# Altium schematic sheet Microocontroller.SchDoc
size A3; SheetNumber: 5; SheetTotal: 6
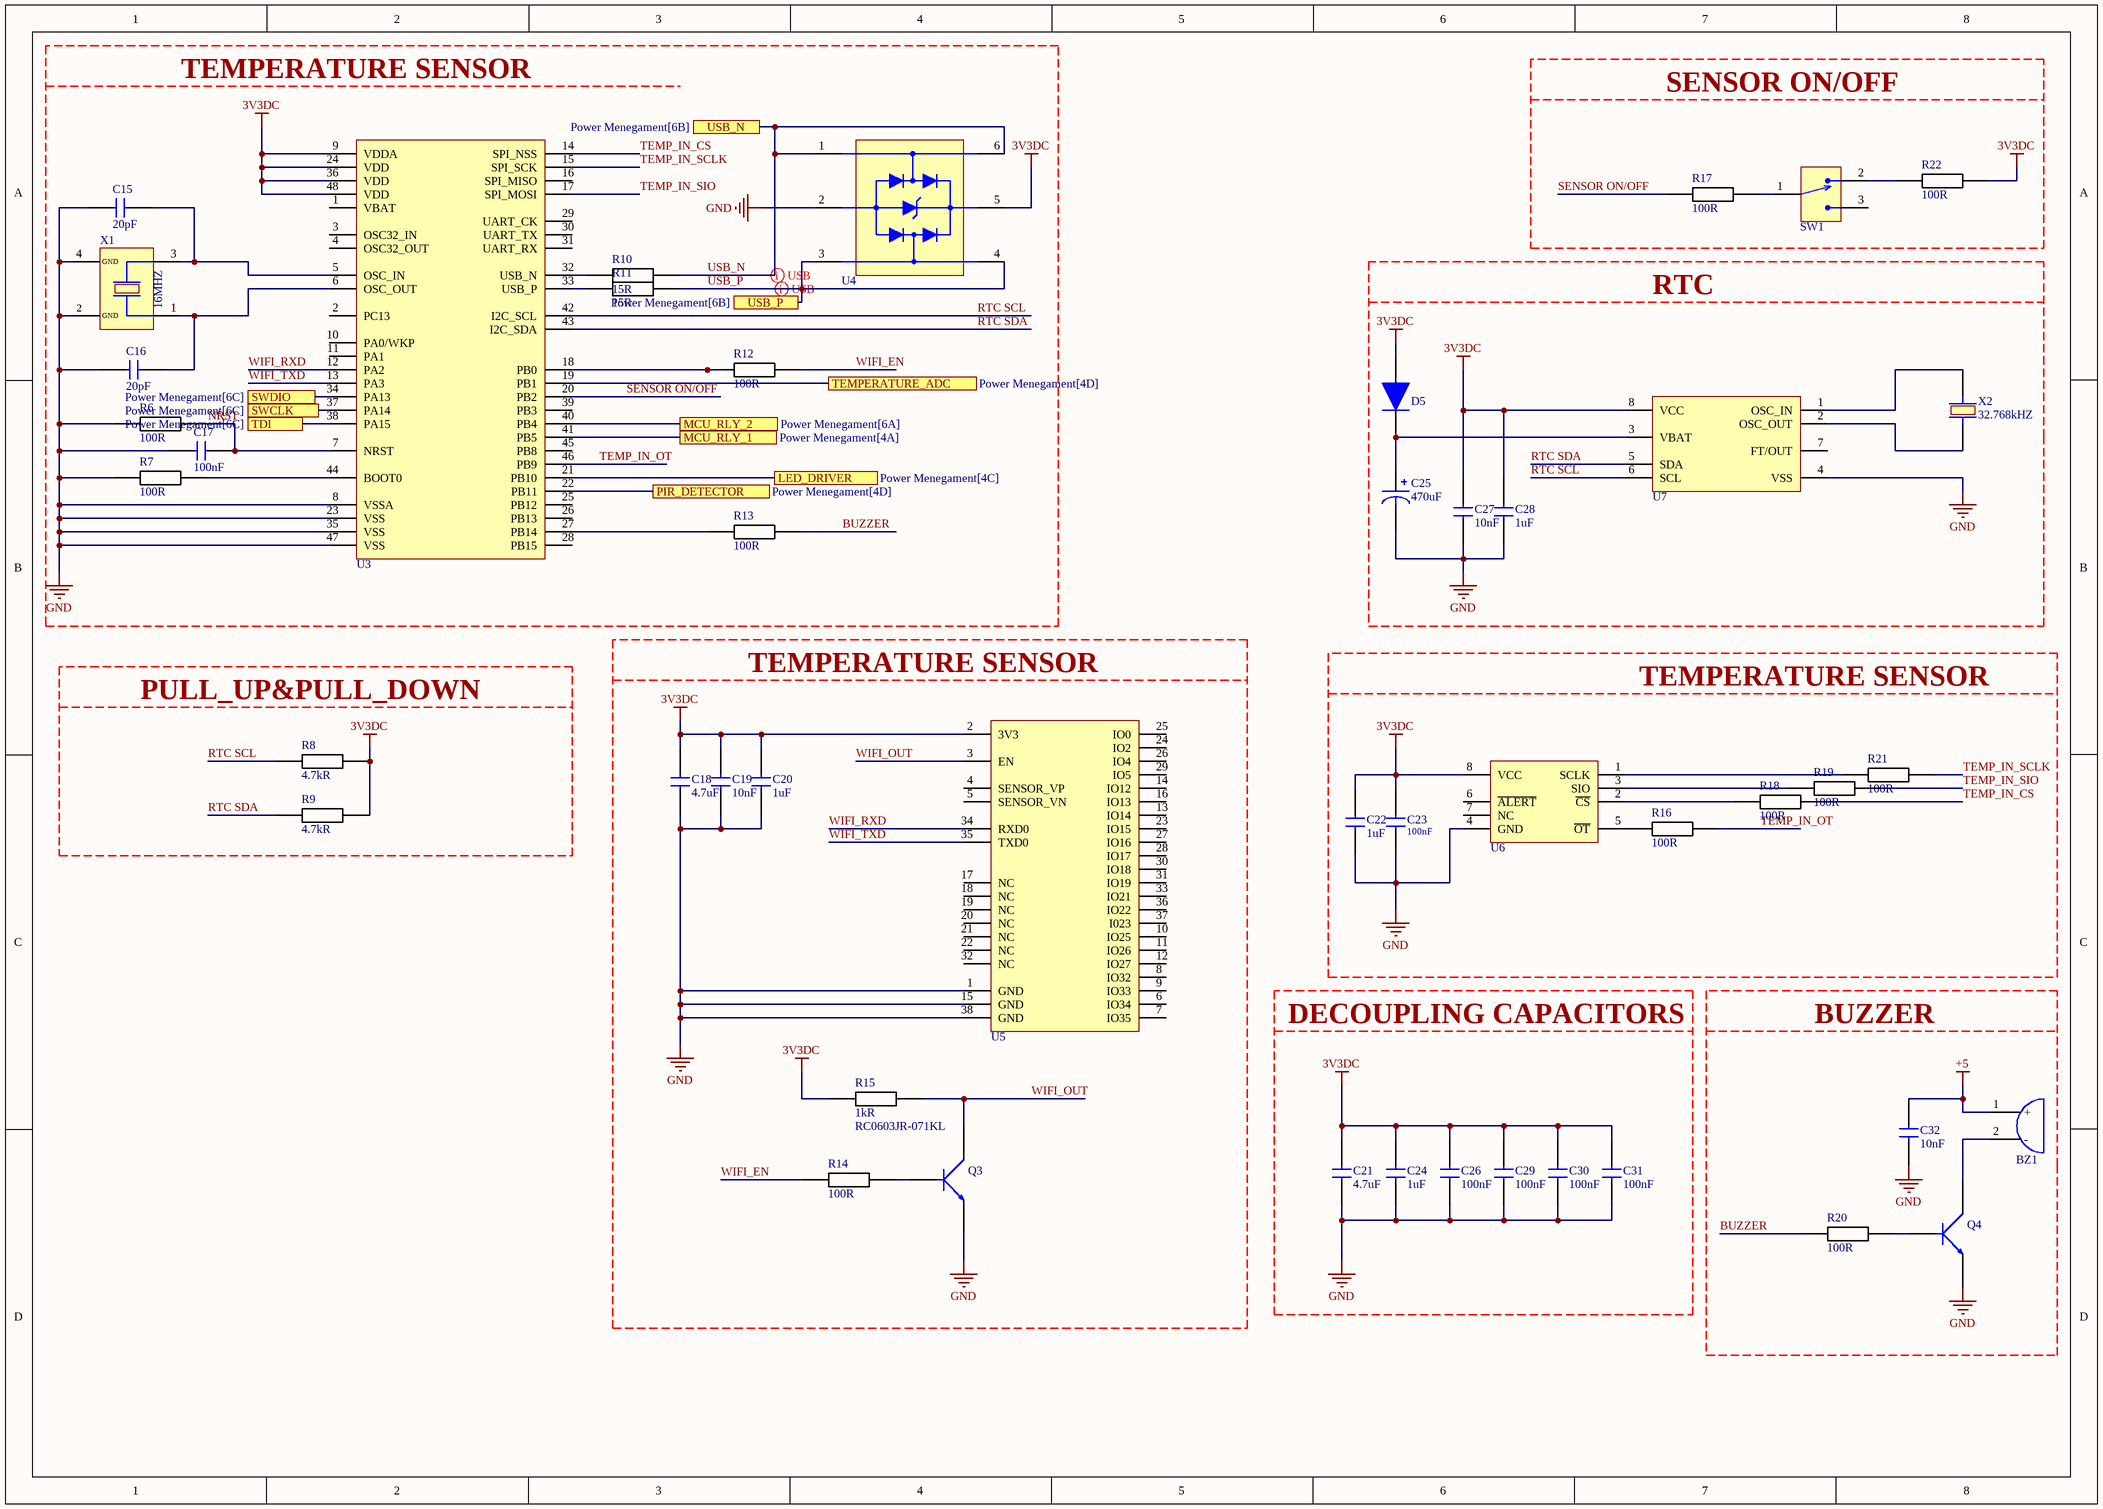
[diagram p0: Microocontroller.SchDoc]

## Parts
BZ1  CMI-9605IC-0580T  [CMI-9605IC]  (value not drawn)
C15  value 20pF  [CAP_0603]  (hidden comment: CL10C200JB8NNNC)
C16  value 20pF  [CAP_0603]  (hidden comment: CL10C200JB8NNNC)
C17  value 100nF  [CAP_0805]  (hidden comment: CL21B104KBCNNNC)
C18  value 4.7uF  [CAP_0805]  (hidden comment: CL21A475KAQNNNE)
C19  value 10nF  [CAP_0603]  (hidden comment: 0603B103K160CT)
C20  value 1uF  [CAP_0805]  (hidden comment: CHA08C105K4RXL7189)
C21  value 4.7uF  [CAP_0805]  (hidden comment: CL21A475KAQNNNE)
C22  value 1uF  [CAP_0805]  (hidden comment: CHA08C105K4RXL7189)
C23  value 100nF  [CAP_0603]  (hidden comment: C0603C104M5RACTU)
C24  value 1uF  [CAP_0805]  (hidden comment: CHA08C105K4RXL7189)
C25  value 470uF  [CAP_RADİAL_D10_R5]  (hidden comment: ESH477M035AH4AA)
C26  value 100nF  [CAP_0805]  (hidden comment: CL21B104KBCNNNC)
C27  value 10nF  [CAP_0603]  (hidden comment: 0603B103K160CT)
C28  value 1uF  [CAP_0805]  (hidden comment: CHA08C105K4RXL7189)
C29  value 100nF  [CAP_0805]  (hidden comment: CL21B104KBCNNNC)
C30  value 100nF  [CAP_0805]  (hidden comment: CL21B104KBCNNNC)
C31  value 100nF  [CAP_0805]  (hidden comment: CL21B104KBCNNNC)
C32  value 10nF  [CAP_0603]  (hidden comment: 0603B103K160CT)
D5  1N4148WS  [SOD323F]  (value not drawn)
Q3  MMBT3904-7-F  [SOT-23F]  (value not drawn)
Q4  MMBT3904-7-F  [SOT-23F]  (value not drawn)
R6  value 100R  [RES_0603]  (hidden comment: RC0603FR-07100RL)
R7  value 100R  [RES_0603]  (hidden comment: RC0603FR-07100RL)
R8  value 4.7kR  [RES_0603]  (hidden comment: RC0603JR-074K7L)
R9  value 4.7kR  [RES_0603]  (hidden comment: RC0603JR-074K7L)
R10  value 15R  [RES_0603]  (hidden comment: RC0603JR-0715RL)
R11  value 15R  [RES_0603]  (hidden comment: RC0603JR-0715RL)
R12  value 100R  [RES_0603]  (hidden comment: RC0603FR-07100RL)
R13  value 100R  [RES_0603]  (hidden comment: RC0603FR-07100RL)
R14  value 100R  [RES_0603]  (hidden comment: RC0603FR-07100RL)
R15  RC0603JR-071KL  value 1kR  [RES_0603]
R16  value 100R  [RES_0603]  (hidden comment: RC0603FR-07100RL)
R17  value 100R  [RES_0603]  (hidden comment: RC0603FR-07100RL)
R18  value 100R  [RES_0603]  (hidden comment: RC0603FR-07100RL)
R19  value 100R  [RES_0603]  (hidden comment: RC0603FR-07100RL)
R20  value 100R  [RES_0603]  (hidden comment: RC0603FR-07100RL)
R21  value 100R  [RES_0603]  (hidden comment: RC0603FR-07100RL)
R22  value 100R  [RES_0603]  (hidden comment: RC0603FR-07100RL)
SW1  EG1215AA  [EG1215AA]  (value not drawn)
U3  STM32F103C6T6A  [LQFP48]  (value not drawn)
U4  USBLC6-2SC6  [SOT-23-6L]  (value not drawn)
U5  ESP32-WROOM-32E-4MB  [ESP32-32E]  (value not drawn)
U6  MAX6662  [SOIC8]  (value not drawn)
U7  M41T00SM6F  [SOIC8]  (value not drawn)
X1  CRYSTAL_Value: 16MHZ  [ECS]  (hidden comment: ECS-160-20-30B-TR)
X2  CRYSTAL_Value: 32.768kHZ  [ABS05]  (hidden comment: ABS05-32.768KHZ-T)

## Blocks framed on the sheet
TEMPERATURE SENSOR: C15-C17 R6 R7 R10-R13 U3 U4 X1
SENSOR ON/OFF: R17 R22 SW1
RTC: C25 C27 C28 D5 U7 X2
PULL_UP&PULL_DOWN: R8 R9
TEMPERATURE SENSOR: C18-C20 Q3 R14 R15 U5
TEMPERATURE SENSOR: C22 C23 R16 R18 R19 R21 U6
DECOUPLING CAPACITORS: C21 C24 C26 C29-C31
BUZZER: BZ1 C32 Q4 R20

## Ports
LED_DRIVER (see Power Menegament[4C]), MCU_RLY_1 (see Power Menegament[4A]), MCU_RLY_2 (see Power Menegament[6A]), PIR_DETECTOR (see Power Menegament[4D]), SWCLK (see Power Menegament[6C]), SWDIO (see Power Menegament[6C]), TDI (see Power Menegament[6C]), TEMPERATURE_ADC (see Power Menegament[4D]), USB_N (see Power Menegament[6B]), USB_P (see Power Menegament[6B])

## Nets
3V3DC: C18.2 C19.2 C20.2 C21.2 C22.2 C23.2 C24.2 C26.2 C27.2 C28.2 C29.2 C30.2 C31.2 D5.2 R8.2 R9.2 R15.1 R22.2 U3.9(VDDA) U3.24(VDD) U3.36(VDD) U3.48(VDD) U4.5 U5.2(3V3) U6.8(VCC) U7.8(VCC)
+5: BZ1.1(+) C32.2
GND: C15.2 C16.1 C17.2 C18.1 C19.1 C20.1 C21.1 C22.1 C23.1 C24.1 C25.2 C26.1 C27.1 C28.1 C29.1 C30.1 C31.1 C32.1 Q3.2(E) Q4.2(E) R6.1 R7.1 U3.8(VSSA) U3.23(VSS) U3.35(VSS) U3.47(VSS) U4.2 U5.1(GND) U5.15(GND) U5.38(GND) U6.4(GND) U7.4(VSS) X1.2(GND) X1.4(GND)
BUZZER: R13.2 R20.1
LED_DRIVER: U3.21(PB10) ; port LED_DRIVER
MCU_RLY_1: U3.41(PB5) ; port MCU_RLY_1
MCU_RLY_2: U3.40(PB4) ; port MCU_RLY_2
NRST: C17.1 R6.2 U3.7(NRST)
PIR_DETECTOR: U3.22(PB11) ; port PIR_DETECTOR
RTC SCL: R8.1 U3.42(I2C_SCL) U7.6(SCL)
RTC SDA: R9.1 U3.43(I2C_SDA) U7.5(SDA)
SENSOR ON/OFF: R17.1 U3.20(PB2)
SWCLK: U3.37(PA14) ; port SWCLK
SWDIO: U3.34(PA13) ; port SWDIO
TDI: U3.38(PA15) ; port TDI
TEMP_IN_CS: R18.2 U3.14(SPI_NSS)
TEMP_IN_OT: R16.2 U3.46(PB9)
TEMP_IN_SCLK: R21.2 U3.15(SPI_SCK)
TEMP_IN_SIO: R19.2 U3.17(SPI_MOSI)
TEMPERATURE_ADC: U3.19(PB1) ; port TEMPERATURE_ADC
USB_N: R10.2 U4.1 U4.6 ; port USB_N
USB_P: R11.2 U4.3 U4.4 ; port USB_P
WIFI_EN: R12.2 R14.1
WIFI_OUT: Q3.3(C) R15.2 U5.3(EN)
WIFI_RXD: U3.12(PA2) U5.34(RXD0)
WIFI_TXD: U3.13(PA3) U5.35(TXD0)
NetBZ1_2: BZ1.2(-) Q4.3(C)
NetC15_1: C15.1 U3.5(OSC_IN) X1.3
NetC16_2: C16.2 U3.6(OSC_OUT) X1.1
NetC25_1: C25.1 D5.1 U7.3(VBAT)
NetQ3_1: Q3.1(B) R14.2
NetQ4_1: Q4.1(B) R20.2
NetR7_2: R7.2 U3.44(BOOT0)
NetR10_1: R10.1 U3.32(USB_N)
NetR11_1: R11.1 U3.33(USB_P)
NetR12_1: R12.1 U3.18(PB0)
NetR13_1: R13.1 U3.27(PB14)
NetR16_1: R16.1 U6.5(~{OT})
NetR17_2: R17.2 SW1.1
NetR18_1: R18.1 U6.2(~{CS})
NetR19_1: R19.1 U6.3(SIO)
NetR21_1: R21.1 U6.1(SCLK)
NetR22_1: R22.1 SW1.2
NetU7_1: U7.1(OSC_IN) X2.2
NetU7_2: U7.2(OSC_OUT) X2.1

Not connected (* = marked no-connect by the designer): SW1 3; U3 1(VBAT) 2(PC13) 3(OSC32_IN) 4(OSC32_OUT) 10(PA0/WKP) 11(PA1) 16(SPI_MISO) 25(PB12) 26(PB13) 28(PB15) 29(UART_CK) 30(UART_TX) 31(UART_RX) 39(PB3) 45(PB8); U5 4(SENSOR_VP) 5(SENSOR_VN) 6(IO34) 7(IO35) 8(IO32) 9(IO33) 10(IO25) 11(IO26) 12(IO27) 13(IO14) 14(IO12) 16(IO13) 17(NC) 18(NC) 19(NC) 20(NC) 21(NC) 22(NC) 23(IO15) 24(IO2) 25(IO0) 26(IO4) 27(IO16) 28(IO17) 29(IO5) 30(IO18) 31(IO19) 32(NC) 33(IO21) 36(IO22) 37(I023); U6 6(~{ALERT}) 7(NC); U7 7(FT/OUT)

## Layout directives
differential pair: USB_N, USB_P

## Library data of the parts
BZ1 = CMI-9605IC-0580T: Buzzers Indicator, Internally Driven Magnetic 5 V 30mA 2.7kHz 80dB @ 5V, 10cm Through Hole PC Pins; Manufacturer: CUI Devices; Designed by: Kerem; Supplier: Digikey; Supplier Part Number: 2223-CMI-9605IC-0580T-ND; Manufacturer Part Number: CMI-9605IC-0580T; RoHS: No; Category: Buzzers; Stock: 3266; Pricing: 1=1,14, 10=0,932, 25=0,8584, 50=0,8072, 150=0,73213, 300=0,73127 (USD); ComponentLink1Description: DATASHEET; ComponentLink1URL: https://www.sameskydevices.com/product/resource/cmi-9605ic-0580t.pdf
C15 C16 = CAP_CER_20pF_0603: Ceramic Capacitor, 50V, 0.00002uF, Surface Mount, 0603; Manufacturer: Samsung; Multilayer: Yes; Tolerance  (fill in as +-): 5%; Temperature Characteristics Code: C0G; Designed by: Kerem; Supplier: Digikey; Supplier Part Number: 1276-1187-1-ND; Manufacturer Part Number: CL10C200JB8NNNC; RoHS: Yes; Category: Ceramic Capacitors; Stock: 238617; Pricing: 1=0,1, 10=0,029, 100=0,0173, 1000=0,01144 (USD); Mounting Technology: Surface Mount; Pins: 2; Dielectric Material: Ceramic; Package Shape: Rectangular; Case/Package: 0603; Terminal Finish: Nickel; Min Operating Temperature: -55°C; Max Operating Temperature: 125°C; JESD-609 Code: e3; Capacitor Type: Ceramic; Package Style: SMTMeter; Packaging: Tape and Reel; Tolerance (fill in as +-): 5%; Rated DC Voltage (URdc): 50V; Termination: Wraparound; Length: 1.6mm; Width: 0.8mm; Height: 0.9mm; Reach SVHC Compliant: Yes; RoHS Compliant: Yes; ComponentLink1URL: https://datasheet.ciiva.com:443/pdfs/VipMasterIC/IC/SEMS/SEMS-S-A0008520096/SEMS-S-A0008519968-1.pdf?src-supplier=IHS+Markit; ComponentLink1Description: https://datasheet.ciiva.com:443/pdfs/VipMasterIC/IC/SEMS/SEMS-S-A0008520096/SEMS-S-A0008519968-1.pdf?src-supplier=IHS+Markit; ComponentLink2URL: https://datasheet.ciiva.com/26877/getdatasheetpartid-640634-26877974.pdf?src-supplier=Verical; ComponentLink2Description: https://datasheet.ciiva.com/26877/getdatasheetpartid-640634-26877974.pdf?src-supplier=Verical; ComponentLink3URL: https://datasheet.ciiva.com/26310/mlcc-catalogdownload2013-eng-26310315.pdf?src-supplier=Distrelec; ComponentLink3Description: https://datasheet.ciiva.com/26310/mlcc-catalogdownload2013-eng-26310315.pdf?src-supplier=Distrelec
C17 C26 C29-C31 = CAP_CER_100nF_0805: Ceramic Capacitor,50V, %10, 0.1uF, Surface Mount, 0805; Manufacturer: Samsung; Multilayer: Yes; Tolerance  (fill in as +-): 10%; Temperature Characteristics Code: X7R; Designed by: Kerem; Supplier: Digikey; Supplier Part Number: 1276-1003-1-ND; Manufacturer Part Number: CL21B104KBCNNNC; RoHS: Yes; Category: Ceramic Capacitors; Stock: 925106; Pricing: 1=0,1, 10=0,029, 100=0,0175, 1000=0,01156 (USD); Mounting Technology: Surface Mount; Pins: 2; Dielectric Material: Ceramic; Package Shape: Rectangular; Case/Package: 0805; Terminal Finish: Nickel; Min Operating Temperature: -55°C; Max Operating Temperature: 125°C; JESD-609 Code: e3; Capacitor Type: Ceramic; Package Style: SMTMeter; Packaging: Tape and Reel; Tolerance (fill in as +-): 10%; Rated DC Voltage (URdc): 50V; Termination: Wraparound; Length: 2mm; Width: 1.25mm; Height: 0.95mm; Reach SVHC Compliant: Yes; RoHS Compliant: Yes; ComponentLink1URL: https://datasheet.ciiva.com:443/pdfs/VipMasterIC/IC/SEMS/SEMS-S-A0008521003/SEMS-S-A0008521039-1.pdf?src-supplier=IHS+Markit; ComponentLink1Description: https://datasheet.ciiva.com:443/pdfs/VipMasterIC/IC/SEMS/SEMS-S-A0008521003/SEMS-S-A0008521039-1.pdf?src-supplier=IHS+Markit; ComponentLink2URL: https://datasheet.ciiva.com/25710/cl21b104kbcnnnc-25710182.pdf?src-supplier=Digikey; ComponentLink2Description: https://datasheet.ciiva.com/25710/cl21b104kbcnnnc-25710182.pdf?src-supplier=Digikey; ComponentLink3URL: https://datasheet.ciiva.com/29199/454152-da-01-en-vs-kondensator-0805-29199814.pdf?src-supplier=Conrad; ComponentLink3Description: https://datasheet.ciiva.com/29199/454152-da-01-en-vs-kondensator-0805-29199814.pdf?src-supplier=Conrad
C18 C21 = CAP_CER_4.7uF_0805: CAP CER 4.7uF,%10, Surface Mount, 0805; Manufacturer: Samsung; Designed by: Kerem; Dielectric Material: Ceramic; Multilayer: Yes; Tolerance  (fill in as +-): 10%; Rated DC Voltage (URdc): 25V; Temperature Characteristics Code: X5R; Supplier: Digikey; Supplier Part Number: 1276-1244-1-ND; Manufacturer Part Number: CL21A475KAQNNNE; RoHS: Yes; Category: Ceramic Capacitors; Stock: 2727040; Pricing: 1=0,1, 10=0,048, 100=0,03, 1000=0,02035 (USD); Mounting Technology: Surface Mount; Pins: 2; Package Shape: Rectangular; Case/Package: 0805; Terminal Finish: Nickel; Min Operating Temperature: -55°C; Max Operating Temperature: 85°C; JESD-609 Code: e3; Capacitor Type: Ceramic; Package Style: SMTMeter; Packaging: Tape and Reel; Tolerance (fill in as +-): 10%; Termination: Wraparound; Length: 2mm; Width: 1.25mm; Height: 1.4mm; Reach SVHC Compliant: Yes; RoHS Compliant: Yes; ComponentLink1URL: https://datasheet.ciiva.com:443/pdfs/VipMasterIC/IC/SEMS/SEMS-S-A0008528919/SEMS-S-A0008528938-1.pdf?src-supplier=IHS+Markit; ComponentLink1Description: https://datasheet.ciiva.com:443/pdfs/VipMasterIC/IC/SEMS/SEMS-S-A0008528919/SEMS-S-A0008528938-1.pdf?src-supplier=IHS+Markit; ComponentLink2URL: https://datasheet.ciiva.com/25798/cl21a475kaqnnne-25798882.pdf?src-supplier=Digikey; ComponentLink2Description: https://datasheet.ciiva.com/25798/cl21a475kaqnnne-25798882.pdf?src-supplier=Digikey
C19 C27 C32 = CAP_CER_10nF_0603: Ceramic Capacitor,16V, 10%, 0.01uF, Surface Mount, 0603; Manufacturer: Walsin Technologies; Designed by: Kerem; Multilayer: Yes; Temperature Characteristics Code: X7R; Supplier: Digikey; Supplier Part Number: 1292-1384-6-ND; Manufacturer Part Number: 0603B103K160CT; RoHS: Yes; Category: Ceramic Capacitors; Stock: 40006; Pricing: 1=0,1, 10=0,031, 50=0,018, 100=0,0139, 500=0,0105, 1000=0,00825 (USD); Mounting Technology: Surface Mount; Pins: 2; Dielectric Material: Ceramic; Case/Package: 0603; Package Shape: Rectangular; Terminal Finish: Nickel; Min Operating Temperature: -55°C; Max Operating Temperature: 125°C; Capacitor Type: Ceramic; Tolerance  (fill in as +-): 10%; Package Style: SMTMeter; Packaging: Tape and Reel; Tolerance (fill in as +-): 10%; Rated DC Voltage (URdc): 16V; JESD-609 Code: e3; Termination: Wraparound; Length: 1.6mm; Width: 0.8mm; Height: 0.8mm; Reach SVHC Compliant: Yes; RoHS Compliant: Yes; ComponentLink1URL: https://datasheet.ciiva.com:443/pdfs/VipMasterIC/IC/WATC/WATC-S-A0009550342/WATC-S-A0009550342-1.pdf?src-supplier=IHS+Markit; ComponentLink1Description: https://datasheet.ciiva.com:443/pdfs/VipMasterIC/IC/WATC/WATC-S-A0009550342/WATC-S-A0009550342-1.pdf?src-supplier=IHS+Markit; ComponentLink2URL: http://www.farnell.com/datasheets/1958513.pdf?src-supplier=Farnell; ComponentLink2Description: http://www.farnell.com/datasheets/1958513.pdf?src-supplier=Farnell; ComponentLink3URL: https://datasheet.octopart.com/0603B103K160CT-Walsin-Technologies-datasheet-85392065.pdf?src-supplier=Element14; ComponentLink3Description: https://datasheet.octopart.com/0603B103K160CT-Walsin-Technologies-datasheet-85392065.pdf?src-supplier=Element14; ComponentLink4URL: http://www.passivecomponent.com/wp-content/uploads/2018/10/MLCC.pdf?src-supplier=Digikey; ComponentLink4Description: http://www.passivecomponent.com/wp-content/uploads/2018/10/MLCC.pdf?src-supplier=Digikey; ComponentLink5URL: https://datasheet.octopart.com/0603B103K160CT-Walsin-Technologies-datasheet-136037192.pdf?src-supplier=Future+Electronics; ComponentLink5Description: https://datasheet.octopart.com/0603B103K160CT-Walsin-Technologies-datasheet-136037192.pdf?src-supplier=Future+Electronics; ComponentLink6URL: https://datasheet.octopart.com/0603B103K160CT-Walsin-Technologies-datasheet-62066062.pdf?src-supplier=TME; ComponentLink6Description: https://datasheet.octopart.com/0603B103K160CT-Walsin-Technologies-datasheet-62066062.pdf?src-supplier=TME
C20 C22 C24 C28 = CAP_CER_1uF_0805: Cap CER, 1uF, 16V, 0805;; Manufacturer: KEMET; Designed by: Kerem; Supplier: Digikey; Supplier Part Number: 399-CHA08C105K4RXL7189DKR-ND; Manufacturer Part Number: CHA08C105K4RXL7189; Stock: 600; Pricing: 1=8,82, 10=6,341, 100=4,9085 (USD); ComponentLink1URL: https://datasheet.octopart.com/CHA08C105K4RXL7189-KEMET-datasheet-181963755.pdf?src-supplier=Farnell; ComponentLink1Description: https://datasheet.octopart.com/CHA08C105K4RXL7189-KEMET-datasheet-181963755.pdf?src-supplier=Farnell
C23 = CAP CER 100nF 0603: 0.1 µF ±20% 50V Ceramic Capacitor X7R 0603 (1608 Metric); Manufacturer: KEMET; Supplier: Digikey; Supplier Part Number: 399-C0603C104M5RACTUCT-ND; Manufacturer Part Number: C0603C104M5RACTU; RoHS: Yes; Category: Ceramic Capacitors; Stock: 3718959; Pricing: 1=0,1, 10=0,023, 100=0,0133, 1000=0,00866, 4000=0,00697, 8000=0,00632, 12000=0,00598, 20000=0,0056, 28000=0,00538, 40000=0,00516, 100000=0,00467, 200000=0,00436, 400000=0,0041 (USD); ComponentLink1URL: http://capacitoredge.kemet.com:80/capedge2/intellispec.jsp?pn=P2015898&displayPN=P2015898&src-supplier=IHS+Markit; ComponentLink1Description: http://capacitoredge.kemet.com:80/capedge2/intellispec.jsp?pn=P2015898&displayPN=P2015898&src-supplier=IHS+Markit; ComponentLink2URL: http://components.arrow.com/part/dataview/40911037S8853915N7429?src-supplier=Arrow+Electronics; ComponentLink2Description: http://components.arrow.com/part/dataview/40911037S8853915N7429?src-supplier=Arrow+Electronics; ComponentLink3URL: http://www.farnell.com/datasheets/2746056.pdf?src-supplier=Farnell; ComponentLink3Description: http://www.farnell.com/datasheets/2746056.pdf?src-supplier=Farnell; ComponentLink4URL: https://www.verical.com/server-webapp/html/getDatasheet?partID=626892&src-supplier=Verical; ComponentLink4Description: https://www.verical.com/server-webapp/html/getDatasheet?partID=626892&src-supplier=Verical; ComponentLink5URL: http://www.mouser.com/ds/2/212/KEM_C1002_X7R_SMD-1102033.pdf?src-supplier=Mouser; ComponentLink5Description: http://www.mouser.com/ds/2/212/KEM_C1002_X7R_SMD-1102033.pdf?src-supplier=Mouser; ComponentLink6URL: http://www.alliedelec.com/m/d/6f3b5eb83d09db50ed28bdc730567b33.pdf?src-supplier=Allied+Electronics; ComponentLink6Description: http://www.alliedelec.com/m/d/6f3b5eb83d09db50ed28bdc730567b33.pdf?src-supplier=Allied+Electronics; ComponentLink7URL: http://www.farnell.com/datasheets/1828800.pdf?src-supplier=Newark; ComponentLink7Description: http://www.farnell.com/datasheets/1828800.pdf?src-supplier=Newark; ComponentLink8URL: https://datasheet.octopart.com/C0603C104M5RACTU-Kemet-datasheet-5313890.pdf?src-supplier=Verical; ComponentLink8Description: https://datasheet.octopart.com/C0603C104M5RACTU-Kemet-datasheet-5313890.pdf?src-supplier=Verical; ComponentLink9URL: http://capacitoredge.kemet.com/capedge2/DataSheet?pn=C0603C104M5RAC7867&src-supplier=Avnet; ComponentLink9Description: http://capacitoredge.kemet.com/capedge2/DataSheet?pn=C0603C104M5RAC7867&src-supplier=Avnet; ComponentLink10URL: http://www.farnell.com/datasheets/2315113.pdf?src-supplier=Newark; ComponentLink10Description: http://www.farnell.com/datasheets/2315113.pdf?src-supplier=Newark; ComponentLink11URL: https://api.kemet.com/component-edge/download/datasheet/C0603C104M5RACTU.pdf?src-supplier=Digikey; ComponentLink11Description: https://api.kemet.com/component-edge/download/datasheet/C0603C104M5RACTU.pdf?src-supplier=Digikey; ComponentLink12URL: https://datasheet.octopart.com/C0603C104M5RACTU-Kemet-datasheet-65850025.pdf?src-supplier=Element14; ComponentLink12Description: https://datasheet.octopart.com/C0603C104M5RACTU-Kemet-datasheet-65850025.pdf?src-supplier=Element14; ComponentLink13URL: http://www.farnell.com/datasheets/2746056.pdf?src-supplier=Element14; ComponentLink13Description: http://www.farnell.com/datasheets/2746056.pdf?src-supplier=Element14; ComponentLink14URL: http://www.farnell.com/datasheets/2746056.pdf?src-supplier=Newark; ComponentLink14Description: http://www.farnell.com/datasheets/2746056.pdf?src-supplier=Newark; ComponentLink15URL: https://datasheet.octopart.com/C0603C104M5RACTU-KEMET-datasheet-157246124.pdf?src-supplier=Electro+Sonic; ComponentLink15Description: https://datasheet.octopart.com/C0603C104M5RACTU-KEMET-datasheet-157246124.pdf?src-supplier=Electro+Sonic; ComponentLink16URL: https://datasheet.octopart.com/C0603C104M5RACTU-KEMET-datasheet-68331906.pdf?src-supplier=TME; ComponentLink16Description: https://datasheet.octopart.com/C0603C104M5RACTU-KEMET-datasheet-68331906.pdf?src-supplier=TME
C25 = CAP_ALU_470uF: Aluminum Electrolytic Capacitor, Polarized, Aluminum (wet), 35V, 20% +Tol, 20% -Tol, 470uF, Through Hole Mount; Manufacturer: KEMET; Dielectric Material: Aluminium; Leakage Current: 167uA; Ripple Current: 580mA; Tan Delta: 0.14; Designed by: Kerem; Supplier: Digikey; Supplier Part Number: 399-ESH477M035AH4AA-ND; Manufacturer Part Number: ESH477M035AH4AA; RoHS: Yes; Category: Aluminum Electrolytic Capacitors; Pricing: 2400=0,16564 (USD); Mounting Technology: Through Hole; Pins: 2; Package Shape: Cylindrical; Min Operating Temperature: -40°C; Max Operating Temperature: 105°C; Polarity: Polarized; Capacitor Type: Aluminium; Tolerance  (fill in as +-): 20%; Package Style: RadialMeter; Packaging: Bulk; Tolerance (fill in as +-): 20%; Rated DC Voltage (URdc): 35V; Termination: Wire; Diameter: 10mm; Length: 19mm; Terminal Pitch: 5mm; Reach SVHC Compliant: Yes; RoHS Compliant: Yes; ComponentLink1URL: https://datasheet.ciiva.com:443/pdfs/VipMasterIC/IC/KEME/KEME-S-A0008512286/KEME-S-A0008512286-1.pdf?src-supplier=IHS+Markit; ComponentLink1Description: https://datasheet.ciiva.com:443/pdfs/VipMasterIC/IC/KEME/KEME-S-A0008512286/KEME-S-A0008512286-1.pdf?src-supplier=IHS+Markit; ComponentLink2URL: https://datasheet.ciiva.com/22627/1794402-22627147.pdf?src-supplier=Farnell; ComponentLink2Description: https://datasheet.ciiva.com/22627/1794402-22627147.pdf?src-supplier=Farnell
D5 = 1N4148WS: Rectifier Diode, 1 Phase, 1 Element, 0.15A, 100V V(RRM), Silicon; Manufacturer: ON Semiconductor / Fairchild; Package Body Material: Plastic; Number of Elements: 1; Max Output current: 150mA; Reverse Recovery Time-Max: 0.004us; Forward Voltage: 1V; Qualification Status: Not Qualified; Designed by: Kerem; Supplier: Digikey; Supplier Part Number: 1N4148WSFSCT-ND; Manufacturer Part Number: 1N4148WS; RoHS: Yes; Category: Rectifier Diodes; Stock: 336004; Pricing: 1=0,11, 10=0,066, 100=0,0485, 500=0,03852, 1000=0,03522 (USD); Pins: 2; Diode Element Material: SILICON; Package Shape: Rectangular; Max Operating Temperature: 150°C; Diode Type: RECTIFIER; JESD-30 Code: R-PDSO-F2; Package Style: SMALL OUTLINEMeter; Rep Pk Reverse Voltage-Max: 100V; Surface Mount: Yes; Terminal Form: Flat; Terminal Position: DUAL; Moisture Sensitivity Level: 1; Reach SVHC Compliant: Yes; RoHS Compliant: Yes; ComponentLink1URL: https://datasheet.ciiva.com:443/pdfs/VipMasterIC/IC/ONSM/ONSM-S-A0003392874/ONSM-S-A0003585195-1.pdf?src-supplier=IHS+Markit; ComponentLink1Description: https://datasheet.ciiva.com:443/pdfs/VipMasterIC/IC/ONSM/ONSM-S-A0003392874/ONSM-S-A0003585195-1.pdf?src-supplier=IHS+Markit; ComponentLink2URL: https://datasheet.ciiva.com/15208/getdatasheetpartid-127819-15208358.pdf?src-supplier=Verical; ComponentLink2Description: https://datasheet.ciiva.com/15208/getdatasheetpartid-127819-15208358.pdf?src-supplier=Verical; ComponentLink3URL: https://datasheet.ciiva.com/8300/1n914bws-8300360.pdf?src-supplier=Avnet; ComponentLink3Description: https://datasheet.ciiva.com/8300/1n914bws-8300360.pdf?src-supplier=Avnet; ComponentLink4URL: https://datasheet.ciiva.com/910/1n4148ws-910381.pdf?src-supplier=Digikey; ComponentLink4Description: https://datasheet.ciiva.com/910/1n4148ws-910381.pdf?src-supplier=Digikey; ComponentLink5URL: https://datasheet.ciiva.com/910/1n4148ws-910382.pdf?src-supplier=Digikey; ComponentLink5Description: https://datasheet.ciiva.com/910/1n4148ws-910382.pdf?src-supplier=Digikey; ComponentLink6URL: https://datasheet.ciiva.com/910/1n4148ws-910380.pdf?src-supplier=Digikey; ComponentLink6Description: https://datasheet.ciiva.com/910/1n4148ws-910380.pdf?src-supplier=Digikey
Q3 Q4 = MMBT3904-7-F: Small Signal Bipolar Transistor, 0.2A I(C), 40V V(BR)CEO, 1-Element, NPN, Silicon; Manufacturer: Diodes Zetex; Designed by: Kerem; Package Body Material: Plastic; Additional Feature: HIGH RELIABILITY; Max Collector Current: 200mA; DC Current Gain-Min (hFE): 30; Number of Elements: 1; Power Dissipation-Max (Abs): 300mW; Time @ Peak Reflow Temperature-Max (s): 40s; Transistor Application: SWITCHING; Frequency: 300MHz; Turn-off Time-Max (toff): 250ns; Turn-on Time-Max (ton): 70ns; Qualification Status: Not Qualified; Supplier: Digikey; Supplier Part Number: MMBT3904-FDICT-ND; Manufacturer Part Number: MMBT3904-7-F; RoHS: Yes; Category: BJTs; Stock: 3621103; Pricing: 1=0,12, 10=0,075, 100=0,0458, 500=0,03304, 1000=0,02888 (USD); Pins: 3; Package Shape: Rectangular; Terminal Finish: Tin; Transistor Element Material: SILICON; Max Operating Temperature: 150°C; JESD-609 Code: e3; Polarity/Channel Type: NPN; Collector-emitter Voltage-Max: 40V; JESD-30 Code: R-PDSO-G3; Moisture Sensitivity Level: 1; Package Style: SMALL OUTLINEMeter; Peak Reflow Temperature (Cel): 260°C; Surface Mount: Yes; Terminal Form: Gull Wing; Terminal Position: DUAL; Reach SVHC Compliant: Yes; RoHS Compliant: Yes; ComponentLink1URL: https://datasheet.ciiva.com:443/pdfs/VipMasterIC/IC/DIOD/DIOD-S-A0003133141/DIOD-S-A0003133141-1.pdf?src-supplier=IHS+Markit; ComponentLink1Description: https://datasheet.ciiva.com:443/pdfs/VipMasterIC/IC/DIOD/DIOD-S-A0003133141/DIOD-S-A0003133141-1.pdf?src-supplier=IHS+Markit; ComponentLink2URL: https://datasheet.ciiva.com/11201/ds30036-11201778.pdf?src-supplier=Avnet; ComponentLink2Description: https://datasheet.ciiva.com/11201/ds30036-11201778.pdf?src-supplier=Avnet; ComponentLink3URL: https://datasheet.ciiva.com/15138/getdatasheetpartid-53265-15138780.pdf?src-supplier=Verical; ComponentLink3Description: https://datasheet.ciiva.com/15138/getdatasheetpartid-53265-15138780.pdf?src-supplier=Verical; ComponentLink4URL: https://datasheet.ciiva.com/22711/1915516-22711750.pdf?src-supplier=Element14; ComponentLink4Description: https://datasheet.ciiva.com/22711/1915516-22711750.pdf?src-supplier=Element14; ComponentLink5URL: https://datasheet.ciiva.com/11198/ds30036-11198999.pdf?src-supplier=Avnet; ComponentLink5Description: https://datasheet.ciiva.com/11198/ds30036-11198999.pdf?src-supplier=Avnet; ComponentLink6URL: https://datasheet.ciiva.com/6361/ds30036-6361256.pdf?src-supplier=Digikey; ComponentLink6Description: https://datasheet.ciiva.com/6361/ds30036-6361256.pdf?src-supplier=Digikey; ComponentLink7URL: https://datasheet.ciiva.com/6361/ds30036-6361254.pdf?src-supplier=Digikey; ComponentLink7Description: https://datasheet.ciiva.com/6361/ds30036-6361254.pdf?src-supplier=Digikey
R6 R7 R12-R14 R16-R22 = RES_100 OHM_0603: 0.1W, 100ohm, 75V, 1% Surface Mount, 0603; Manufacturer: Yageo; Additional Feature: LASER TRIMMABLE; Power: 100mW; Rated Temperature: 70°C; Temperature Coefficient (ppm/Cel): 100; Package Height: 0.45mm; Package Length: 1.6mm; Package Width: 0.8mm; Designed by: Kerem; Supplier: Digikey; Supplier Part Number: 311-100HRTR-ND; Manufacturer Part Number: RC0603FR-07100RL; RoHS: Yes; Category: Chip SMD Resistors; Stock: 845000; Pricing: 5000=0,00306, 10000=0,00204, 15000=0,0019 (USD); Mounting Technology: Surface Mount; Pins: 2; Package Shape: Rectangular; Case/Package: 0603; Terminal Finish: Nickel; Min Operating Temperature: -55°C; Max Operating Temperature: 155°C; Tolerance: 1%; JESD-609 Code: e3; Resistor Type: FIXED RESISTOR; Construction: Chip; Packaging: Tape and Reel; Technology: METAL GLAZE/THICK FILM; Termination: Wraparound; Working Voltage: 75V; Reach SVHC Compliant: Yes; RoHS Compliant: Yes; ComponentLink1URL: https://datasheet.ciiva.com:443/pdfs/VipMasterIC/IC/YAGO/YAGO-S-A0008145938/YAGO-S-A0008145938-1.pdf?src-supplier=IHS+Markit; ComponentLink1Description: https://datasheet.ciiva.com:443/pdfs/VipMasterIC/IC/YAGO/YAGO-S-A0008145938/YAGO-S-A0008145938-1.pdf?src-supplier=IHS+Markit
R8 R9 = RES_4K7 OHM_0603: 0.1W, 4700ohm, 75V, 5% Surface Mount, 0603; Manufacturer: Yageo; Additional Feature: LASER TRIMMABLE; Power: 100mW; Rated Temperature: 70°C; Temperature Coefficient (ppm/Cel): 100; Package Height: 0.45mm; Package Length: 1.6mm; Package Width: 0.8mm; Designed by: Kerem; Supplier: Digikey; Supplier Part Number: 311-4.7KGRCT-ND; Manufacturer Part Number: RC0603JR-074K7L; RoHS: Yes; Category: Chip SMD Resistors; Stock: 3683881; Pricing: 1=0,1, 10=0,008, 50=0,0072, 100=0,0061, 500=0,0056, 1000=0,0051, 5000=0,00204, 10000=0,00186, 15000=0,00172, 25000=0,0016 (USD); Mounting Technology: Surface Mount; Pins: 2; Package Shape: Rectangular; Case/Package: 0603; Terminal Finish: Nickel; Min Operating Temperature: -55°C; Max Operating Temperature: 155°C; Tolerance: 5%; JESD-609 Code: e3; Resistor Type: FIXED RESISTOR; Construction: Chip; Packaging: Tape and Reel; Technology: METAL GLAZE/THICK FILM; Termination: Wraparound; Working Voltage: 75V; Reach SVHC Compliant: Yes; RoHS Compliant: Yes; ComponentLink1URL: https://datasheet.ciiva.com:443/pdfs/VipMasterIC/IC/YAGO/YAGO-S-A0008145938/YAGO-S-A0008145938-1.pdf?src-supplier=IHS+Markit; ComponentLink1Description: https://datasheet.ciiva.com:443/pdfs/VipMasterIC/IC/YAGO/YAGO-S-A0008145938/YAGO-S-A0008145938-1.pdf?src-supplier=IHS+Markit; ComponentLink2URL: https://datasheet.ciiva.com/46412/443971-46412858.pdf?src-supplier=Element14; ComponentLink2Description: https://datasheet.ciiva.com/46412/443971-46412858.pdf?src-supplier=Element14
R10 R11 = RES_15 OHM_0603: Fixed Resistor, 0.1W, 15ohm, 75V, 5% Surface Mount, 0603; Manufacturer: Yageo; Designed by: Kerem; Additional Feature: LASER TRIMMABLE; Power: 100mW; Rated Temperature: 70°C; Temperature Coefficient (ppm/Cel): 100; Package Height: 0.45mm; Package Length: 1.6mm; Package Width: 0.8mm; Supplier: Digikey; Supplier Part Number: 311-15GRCT-ND; Manufacturer Part Number: RC0603JR-0715RL; RoHS: Yes; Category: Chip SMD Resistors; Stock: 90094; Pricing: 1=0,1, 10=0,008, 50=0,0072, 100=0,0061, 500=0,0051, 1000=0,00408 (USD); Mounting Technology: Surface Mount; Pins: 2; Package Shape: Rectangular; Case/Package: 0603; Terminal Finish: Nickel; Min Operating Temperature: -55°C; Max Operating Temperature: 155°C; Tolerance: 5%; JESD-609 Code: e3; Resistor Type: FIXED RESISTOR; Construction: Chip; Packaging: Tape and Reel; Technology: METAL GLAZE/THICK FILM; Termination: Wraparound; Working Voltage: 75V; Reach SVHC Compliant: Yes; RoHS Compliant: Yes; ComponentLink1URL: https://datasheet.ciiva.com:443/pdfs/VipMasterIC/IC/YAGO/YAGO-S-A0008145938/YAGO-S-A0008145938-1.pdf?src-supplier=IHS+Markit; ComponentLink1Description: https://datasheet.ciiva.com:443/pdfs/VipMasterIC/IC/YAGO/YAGO-S-A0008145938/YAGO-S-A0008145938-1.pdf?src-supplier=IHS+Markit; ComponentLink2URL: https://datasheet.ciiva.com/2453/pyu-r-int-thick-7-2453085.pdf?src-supplier=Digikey; ComponentLink2Description: https://datasheet.ciiva.com/2453/pyu-r-int-thick-7-2453085.pdf?src-supplier=Digikey; ComponentLink3URL: https://datasheet.ciiva.com/2453/pyu-r-int-thick-7-2453086.pdf?src-supplier=Digikey; ComponentLink3Description: https://datasheet.ciiva.com/2453/pyu-r-int-thick-7-2453086.pdf?src-supplier=Digikey; ComponentLink4URL: https://datasheet.ciiva.com/2453/pyu-r-int-thick-7-2453087.pdf?src-supplier=Digikey; ComponentLink4Description: https://datasheet.ciiva.com/2453/pyu-r-int-thick-7-2453087.pdf?src-supplier=Digikey; ComponentLink5URL: https://datasheet.ciiva.com/7746/443971-7746445.pdf?src-supplier=Element14; ComponentLink5Description: https://datasheet.ciiva.com/7746/443971-7746445.pdf?src-supplier=Element14; ComponentLink6URL: https://datasheet.ciiva.com/7746/443971-7746446.pdf?src-supplier=Element14; ComponentLink6Description: https://datasheet.ciiva.com/7746/443971-7746446.pdf?src-supplier=Element14
R15 = RES_1K OHM_0603: 0.1W, 1000ohm, 75V, 5%, Surface Mount, 0603; Manufacturer: Yageo; Additional Feature: LASER TRIMMABLE; Power: 100mW; Rated Temperature: 70°C; Temperature Coefficient (ppm/Cel): 100; Package Height: 0.45mm; Package Length: 1.6mm; Package Width: 0.8mm; Designed by: Kerem; Supplier: Digikey; Supplier Part Number: 311-1.0KGRCT-ND; Manufacturer Part Number: RC0603JR-071KL; RoHS: Yes; Category: Chip SMD Resistors; Stock: 732542; Pricing: 1=0,1, 10=0,01, 50=0,0082, 100=0,0061, 500=0,0056, 1000=0,0051 (USD); Mounting Technology: Surface Mount; Pins: 2; Package Shape: Rectangular; Case/Package: 0603; Terminal Finish: Nickel; Min Operating Temperature: -55°C; Max Operating Temperature: 155°C; Tolerance: 5%; JESD-609 Code: e3; Resistor Type: FIXED RESISTOR; Construction: Chip; Packaging: Tape and Reel; Technology: METAL GLAZE/THICK FILM; Termination: Wraparound; Working Voltage: 75V; Reach SVHC Compliant: Yes; RoHS Compliant: Yes; ComponentLink1URL: https://datasheet.ciiva.com:443/pdfs/VipMasterIC/IC/YAGO/YAGO-S-A0008145938/YAGO-S-A0008145938-1.pdf?src-supplier=IHS+Markit; ComponentLink1Description: https://datasheet.ciiva.com:443/pdfs/VipMasterIC/IC/YAGO/YAGO-S-A0008145938/YAGO-S-A0008145938-1.pdf?src-supplier=IHS+Markit
SW1 = EG1215AA: Slide Switch; Manufacturer: E-Switch; Designed by: Kerem; Supplier: Digikey; Supplier Part Number: EG5720CT-ND; Manufacturer Part Number: EG1215AA; RoHS: Yes; Category: LDO; Stock: 611; Pricing: 1=1,18, 10=0,963, 25=0,8868, 100=0,7809, 250=0,71708, 500=0,67178, 1000=0,62888 (USD); ComponentLink1URL: https://media.digikey.com/pdf/Data%20Sheets/E-Switch%20PDFs/EG1215_Series_Ds.pdf?src-supplier=Digikey; ComponentLink1Description: https://media.digikey.com/pdf/Data%20Sheets/E-Switch%20PDFs/EG1215_Series_Ds.pdf?src-supplier=Digikey; ComponentLink2URL: http://www.farnell.com/datasheets/2645007.pdf?src-supplier=Farnell; ComponentLink2Description: http://www.farnell.com/datasheets/2645007.pdf?src-supplier=Farnell
U3 = STM32F103C6T6A: RISC Microcontroller, 32-Bit, FLASH, CORTEX-M3 CPU, 72MHz, CMOS, PQFP48; Manufacturer: STMicroelectronics; Package Body Material: Plastic; Package Equivalence Code: QFP48,.35SQ,20; Power Supplies: 2.5/3.3; Max Supply Current: 45mA; Time @ Peak Reflow Temperature-Max (s): 40s; Qualification Status: Not Qualified; Designed by: Kerem; Supplier: Arrow Electronics; Supplier Part Number: STM32F103C6T6A; Manufacturer Part Number: STM32F103C6T6A; RoHS: Yes; Category: Microcontrollers; Stock: 2468; Pricing: 1=4,345, 10=3,526, 25=3,238, 50=3,064, 100=3,008, 250=2,871, 500=2,719 (USD); Case/Package: QFP; Pins: 48; Package Shape: Square; Terminal Finish: Nickel; Min Operating Temperature: -40°C; Max Operating Temperature: 85°C; JESD-609 Code: e4; JESD-30 Code: S-PQFP-G48; Moisture Sensitivity Level: 3; Peak Reflow Temperature (Cel): 260°C; Surface Mount: Yes; Technology: CMOS; Terminal Form: Gull Wing; Terminal Position: QUAD; Terminal Pitch: 0.5mm; Temperature Grade: INDUSTRIAL; Reach SVHC Compliant: Yes; RoHS Compliant: Yes; ComponentLink1URL: https://datasheet.ciiva.com:443/pdfs/VipMasterIC/IC/SGST/SGST-S-A0001117150/SGST-S-A0001117150-1.pdf?src-supplier=IHS+Markit; ComponentLink1Description: https://datasheet.ciiva.com:443/pdfs/VipMasterIC/IC/SGST/SGST-S-A0001117150/SGST-S-A0001117150-1.pdf?src-supplier=IHS+Markit; ComponentLink2URL: https://datasheet.ciiva.com/15122/getdatasheetpartid-69879-15122075.pdf?src-supplier=Verical; ComponentLink2Description: https://datasheet.ciiva.com/15122/getdatasheetpartid-69879-15122075.pdf?src-supplier=Verical; ComponentLink3URL: https://datasheet.ciiva.com/14100/pustm-arm-microcont-stm32f103-en-14100507.pdf?src-supplier=Distrelec; ComponentLink3Description: https://datasheet.ciiva.com/14100/pustm-arm-microcont-stm32f103-en-14100507.pdf?src-supplier=Distrelec
U4 = USB PROTECTION: Trans Voltage Suppressor Diode, 5V V(RWM), Unidirectional, 1 Element, Silicon; Manufacturer: STMicroelectronics; Package Body Material: Plastic; Additional Feature: HIGH RELIABILITY; Min Breakdown Voltage: 6V; Number of Elements: 1; Clamping Voltage-Max: 17V; Reference Standard: IEC-61000-4-2; Qualification Status: Not Qualified; Designed by: Kerem; Supplier: Digikey; Supplier Part Number: 497-5235-1-ND; Manufacturer Part Number: USBLC6-2SC6; RoHS: Yes; Category: TVS Diodes; Stock: 58502; Pricing: 1=0,36, 10=0,243, 100=0,163, 500=0,127, 1000=0,114, 3000=0,079, 6000=0,07781 (USD); Pins: 6; Package Shape: Rectangular; Terminal Finish: Tin; Diode Element Material: SILICON; Min Operating Temperature: -40°C; Max Operating Temperature: 125°C; JESD-609 Code: e3; Polarity: Unidirectional; Package Style: SMALL OUTLINEMeter; Diode Type: TRANS VOLTAGE SUPPRESSOR; JESD-30 Code: R-PDSO-G6; Moisture Sensitivity Level: 1; Rep Pk Reverse Voltage-Max: 5V; Surface Mount: Yes; Technology: AVALANCHE; Terminal Form: Gull Wing; Terminal Position: DUAL; Peak Reflow Temperature (Cel): 260°C; Reach SVHC Compliant: Yes; RoHS Compliant: Yes; ComponentLink1URL: https://datasheet.ciiva.com:443/pdfs/VipMasterIC/IC/SGST/SGSTS30336/SGSTS30336-1.pdf?src-supplier=IHS+Markit; ComponentLink1Description: https://datasheet.ciiva.com:443/pdfs/VipMasterIC/IC/SGST/SGSTS30336/SGSTS30336-1.pdf?src-supplier=IHS+Markit; ComponentLink2URL: https://datasheet.ciiva.com/1268/1690354-1268384.pdf?src-supplier=Element14; ComponentLink2Description: https://datasheet.ciiva.com/1268/1690354-1268384.pdf?src-supplier=Element14; ComponentLink3URL: https://datasheet.ciiva.com/4508/cd00050750-113117-4508433.pdf?src-supplier=Mouser; ComponentLink3Description: https://datasheet.ciiva.com/4508/cd00050750-113117-4508433.pdf?src-supplier=Mouser; ComponentLink4URL: https://datasheet.ciiva.com/15143/getdatasheetpartid-148465-15143789.pdf?src-supplier=Verical; ComponentLink4Description: https://datasheet.ciiva.com/15143/getdatasheetpartid-148465-15143789.pdf?src-supplier=Verical; ComponentLink5URL: https://datasheet.ciiva.com/16200/cd00050750-16200026.pdf?src-supplier=Future+Electronics; ComponentLink5Description: https://datasheet.ciiva.com/16200/cd00050750-16200026.pdf?src-supplier=Future+Electronics; ComponentLink6URL: https://datasheet.ciiva.com/41444/001184109-da-01-en-ic-esd-protecti-usblc6-2sc6-sot-23-6-stm-41444156.pdf?src-supplier=Conrad; ComponentLink6Description: https://datasheet.ciiva.com/41444/001184109-da-01-en-ic-esd-protecti-usblc6-2sc6-sot-23-6-stm-41444156.pdf?src-supplier=Conrad
U5 = ESP32-WROOM-32E-4MB: SMD module, ESP32-D0WD-V3, ESP32 ECO V3, 4 MB SPI flash, PCB antenna; Manufacturer: Espressif Systems; Manufacturer Part Number: ESP32-WROOM-32E(M113EH3200PH3Q0); Designed by: Kerem; Power Supplies: 3.0 ~ 3.6 V; Supplier: Digikey; Supplier Part Number: 1904-ESP32-WROOM-32E(M113EH3200PH3Q0)TR-ND; RoHS: No; Category: RF Receivers, Transceivers; Pricing: 6500=2,5 (USD); Min Operating Temperature: -40 °C; Max Operating Temperature: 80 °C; ComponentLink1Description: Datasheet; ComponentLink1URL: https://www.espressif.com/sites/default/files/documentation/esp32-wroom-32e_esp32-wroom-32ue_datasheet_en.pdf
U6 = MAX6662: Serial Switch/Digital Sensor, 12 Bit(s), 2.50Cel, BICMOS, Rectangular, 8 Pin, Surface Mount; Manufacturer: Maxim; Manufacturer Part Number: MAX6662MSA+; Package Body Material: Plastic; Accuracy-Max (Cel): 2.5°C; Number of Bits: 12; Operating Current-Max: 120uA; Output Interface Type: 3-WIRE; Package Equivalence Code: SOP8,.25; Power Supplies: 3.3/5V; Sensor Type: TEMPERATURE SENSOR,SWITCH/DIGITAL OUTPUT,SERIAL; Body Breadth: 3.9mm; Body Height: 1.72mm; Body Length or Diameter: 4.89mm; Designed by: Kerem; Supplier: Digikey; Supplier Part Number: MAX6662MSA+-ND; RoHS: Yes; Category: Temperature and Humidity Sensors; Stock: 320; Pricing: 1=4,11, 5=3,576, 10=3,387, 25=3,1672, 50=3,0212, 100=2,8904, 500=2,63676, 1000=2,54588 (USD); Mounting Technology: Surface Mount; Pins: 8; Housing Material: Plastic; Package Shape/Style: Rectangular; Terminal Finish: Tin; Min Operating Temperature: -55°C; Max Operating Temperature: 125°C; JESD-609 Code: e3; Technology: BICMOS; Termination: Solder; Reach SVHC Compliant: Yes; RoHS Compliant: Yes; ComponentLink1URL: https://datasheet.ciiva.com:443/pdfs/VipMasterIC/IC/MAXM/MAXMS01802/MAXMS01802-1.pdf?src-supplier=IHS+Markit; ComponentLink1Description: https://datasheet.ciiva.com:443/pdfs/VipMasterIC/IC/MAXM/MAXMS01802/MAXMS01802-1.pdf?src-supplier=IHS+Markit; ComponentLink2URL: https://datasheet.ciiva.com/5299/max6662-89142-5299456.pdf?src-supplier=Mouser; ComponentLink2Description: https://datasheet.ciiva.com/5299/max6662-89142-5299456.pdf?src-supplier=Mouser; ComponentLink3URL: https://datasheet.ciiva.com/3277/max6662-3277979.pdf?src-supplier=Avnet; ComponentLink3Description: https://datasheet.ciiva.com/3277/max6662-3277979.pdf?src-supplier=Avnet; ComponentLink4URL: https://datasheet.ciiva.com/2003/max6662-2003390.pdf?src-supplier=Digikey; ComponentLink4Description: https://datasheet.ciiva.com/2003/max6662-2003390.pdf?src-supplier=Digikey; Case/Package: SO-8
U7 = M41T00SM6F: Real Time Clock, Volatile, 0 Timer(s), CMOS, PDSO8; Manufacturer: STMicroelectronics; Package Body Material: Plastic; Clock Frequency: 32kHz; Package Equivalence Code: SOP8,.25; Power Supplies: 3/5V; Max Supply Voltage: 5.5V; Min Supply Voltage: 2.7V; Time @ Peak Reflow Temperature-Max (s): 30s; Qualification Status: Not Qualified; Designed by: Kerem; Supplier: Digikey; Supplier Part Number: 497-6458-1-ND; Manufacturer Part Number: M41T00SM6F; RoHS: Yes; Category: Real Time Clocks; Stock: 4561; Pricing: 1=3,32, 10=2,495, 25=2,288, 100=2,0608, 250=1,9524, 500=1,88706, 1000=1,83327 (USD); Case/Package: SOP; Pins: 8; Package Shape: Rectangular; Terminal Finish: Nickel; Min Operating Temperature: -40°C; Max Operating Temperature: 85°C; JESD-609 Code: e4; JESD-30 Code: R-PDSO-G8; Moisture Sensitivity Level: 1; Package Style: SMALL OUTLINEMeter; Peak Reflow Temperature (Cel): 260°C; Surface Mount: Yes; Technology: CMOS; Terminal Form: Gull Wing; Terminal Position: DUAL; Length: 4.9mm; Width: 3.9mm; Height - Seated (Max): 1.75mm; Terminal Pitch: 1.27mm; Reach SVHC Compliant: Yes; RoHS Compliant: Yes; Temperature Grade: INDUSTRIAL; ComponentLink1URL: https://datasheet.ciiva.com:443/pdfs/VipMasterIC/IC/SGST/SGSTS30285/SGSTS30285-1.pdf?src-supplier=IHS+Markit; ComponentLink1Description: https://datasheet.ciiva.com:443/pdfs/VipMasterIC/IC/SGST/SGSTS30285/SGSTS30285-1.pdf?src-supplier=IHS+Markit; ComponentLink2URL: https://datasheet.ciiva.com/4772/cd00043079-112038-4772343.pdf?src-supplier=Mouser; ComponentLink2Description: https://datasheet.ciiva.com/4772/cd00043079-112038-4772343.pdf?src-supplier=Mouser
X1 = CRYSTLA_16MHZ: Parallel - Fundamental Quartz Crystal, 16MHz Nom; Manufacturer: ECS International; Aging: 5 PPM/FIRST YEAR; Drive Level: 100uW; Frequency Stability: 0.005%; Frequency Tolerance: 30ppm; Load Capacitance: 20pF; Operating Frequency-Nom: 160; ESR: 50R; Designed by: Kerem; Supplier: Digikey; Supplier Part Number: XC1120CT-ND; Manufacturer Part Number: ECS-160-20-30B-TR; RoHS: Yes; Category: Crystals; Stock: 14914; Pricing: 1=0,66, 10=0,58, 50=0,5182, 100=0,4968, 500=0,4504 (USD); Mounting Technology: Surface Mount; Terminal Finish: Gold; Min Operating Temperature: -20°C; Max Operating Temperature: 70°C; JESD-609 Code: e4; Crystal/Resonator Type: PARALLEL - FUNDAMENTAL; Reach SVHC Compliant: Yes; RoHS Compliant: Yes; ComponentLink1URL: https://datasheet.ciiva.com:443/pdfs/VipMasterIC/IC/ECSI/ECSI-S-A0003724562/ECSI-S-A0003724562-1.pdf?src-supplier=IHS+Markit; ComponentLink1Description: https://datasheet.ciiva.com:443/pdfs/VipMasterIC/IC/ECSI/ECSI-S-A0003724562/ECSI-S-A0003724562-1.pdf?src-supplier=IHS+Markit; ComponentLink2URL: https://datasheet.ciiva.com/853/ecx-53b-853408.pdf?src-supplier=Digikey; ComponentLink2Description: https://datasheet.ciiva.com/853/ecx-53b-853408.pdf?src-supplier=Digikey; ComponentLink3URL: https://datasheet.ciiva.com/853/ecx-53b-853407.pdf?src-supplier=Digikey; ComponentLink3Description: https://datasheet.ciiva.com/853/ecx-53b-853407.pdf?src-supplier=Digikey; ComponentLink4URL: https://datasheet.ciiva.com/853/ecx-53b-853406.pdf?src-supplier=Digikey; ComponentLink4Description: https://datasheet.ciiva.com/853/ecx-53b-853406.pdf?src-supplier=Digikey
X2 = CRYSTAL_32768kHZ: Parallel - Fundamental Quartz Crystal, 0.032768MHz Nom; Manufacturer: Abracon; Additional Feature: TAPE AND REEL; Drive Level: 0.5uW; Frequency Stability: 0.0072%; Frequency Tolerance: 20ppm; Load Capacitance: 12.5pF; ESR: 90kR; Designed by: Kerem; Supplier: Digikey; Supplier Part Number: 535-11899-1-ND; Manufacturer Part Number: ABS05-32.768KHZ-T; RoHS: Yes; Category: Crystals; Stock: 97792; Pricing: 1=0,66, 10=0,57, 50=0,517, 100=0,4956, 500=0,44932, 1000=0,43073 (USD); Mounting Technology: Surface Mount; Min Operating Temperature: -40°C; Max Operating Temperature: 85°C; Crystal/Resonator Type: PARALLEL - FUNDAMENTAL; Manufacturer Series: ABS05; Operating Frequency-Nom: 0.032768; Reach SVHC Compliant: Yes; RoHS Compliant: Yes; ComponentLink1URL: https://datasheet.ciiva.com:443/pdfs/VipMasterIC/IC/ABRC/ABRC-S-A0001211237/ABRC-S-A0001211237-1.pdf?src-supplier=IHS+Markit; ComponentLink1Description: https://datasheet.ciiva.com:443/pdfs/VipMasterIC/IC/ABRC/ABRC-S-A0001211237/ABRC-S-A0001211237-1.pdf?src-supplier=IHS+Markit; ComponentLink2URL: https://datasheet.ciiva.com/23810/abs05-23810480.pdf?src-supplier=Newark; ComponentLink2Description: https://datasheet.ciiva.com/23810/abs05-23810480.pdf?src-supplier=Newark; ComponentLink3URL: https://datasheet.ciiva.com/6728/abs05-6728950.pdf?src-supplier=Digikey; ComponentLink3Description: https://datasheet.ciiva.com/6728/abs05-6728950.pdf?src-supplier=Digikey; ComponentLink4URL: https://datasheet.ciiva.com/6728/abs05-6728949.pdf?src-supplier=Digikey; ComponentLink4Description: https://datasheet.ciiva.com/6728/abs05-6728949.pdf?src-supplier=Digikey; ComponentLink5URL: https://datasheet.ciiva.com/16411/abs05-16411149.pdf?src-supplier=Future+Electronics; ComponentLink5Description: https://datasheet.ciiva.com/16411/abs05-16411149.pdf?src-supplier=Future+Electronics